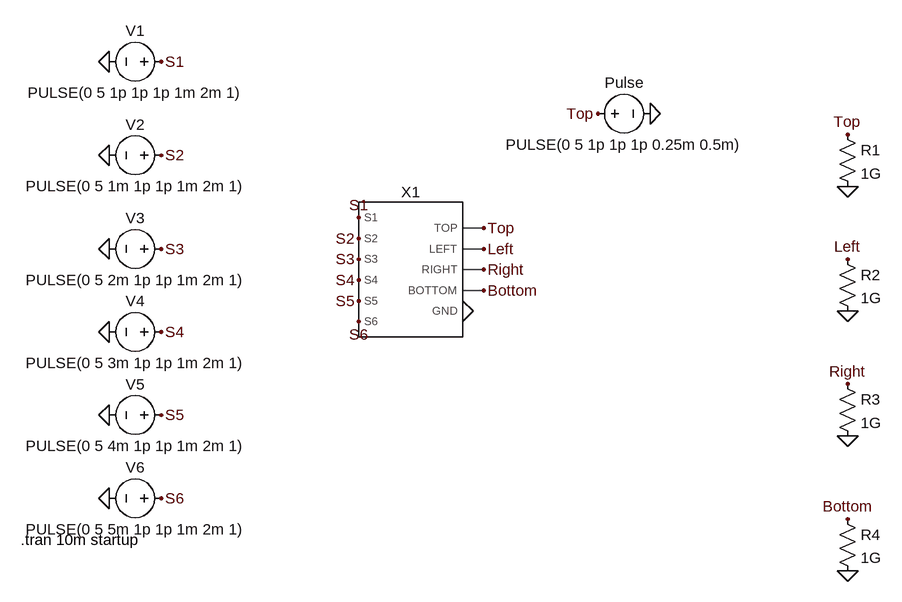
[diagram p0: schematic switch_matrix_test.asc]
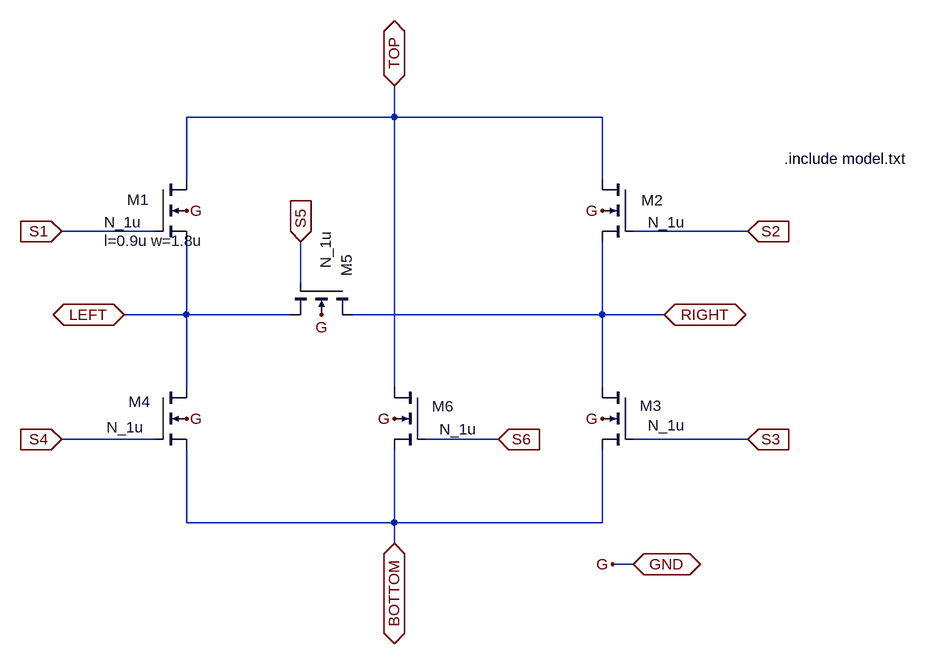
[diagram p1: sub-circuit switch_mat_new.asc]
switch_matrix_test.asc, the LTspice schematic file:
Version 4
SHEET 1 1036 704
WIRE 336 112 304 112
WIRE 336 144 304 144
WIRE 336 176 304 176
WIRE 336 208 304 208
FLAG 304 240 0
FLAG 144 96 S1
FLAG -160 -144 S1
FLAG -160 0 S2
FLAG -160 144 S3
FLAG -160 272 S4
FLAG -160 400 S5
FLAG -160 528 S6
FLAG 144 128 S2
FLAG 144 160 S3
FLAG 144 192 S4
FLAG 144 224 S5
FLAG 144 256 S6
FLAG 336 112 Top
FLAG 336 176 Right
FLAG 336 208 Bottom
FLAG 336 144 Left
FLAG -240 -144 0
FLAG -240 0 0
FLAG -240 144 0
FLAG -240 272 0
FLAG -240 400 0
FLAG -240 528 0
FLAG 592 -64 0
FLAG 512 -64 Top
FLAG 896 48 0
FLAG 896 240 0
FLAG 896 432 0
FLAG 896 640 0
FLAG 896 -32 Top
FLAG 896 160 Left
FLAG 896 352 Right
FLAG 896 560 Bottom
SYMBOL voltage -144 -144 R90
WINDOW 0 -32 56 VBottom 2
WINDOW 3 32 56 VTop 2
WINDOW 123 0 0 Left 0
WINDOW 39 0 0 Left 0
SYMATTR InstName V1
SYMATTR Value PULSE(0 5 1p 1p 1p 1m 2m 1)
SYMBOL voltage 496 -64 M90
WINDOW 0 -32 56 VBottom 2
WINDOW 3 32 56 VTop 2
WINDOW 123 0 0 Left 0
WINDOW 39 0 0 Left 0
SYMATTR InstName Pulse
SYMATTR Value PULSE(0 5 1p 1p 1p 0.25m 0.5m)
SYMBOL voltage -144 0 R90
WINDOW 0 -32 56 VBottom 2
WINDOW 3 32 56 VTop 2
WINDOW 123 0 0 Left 0
WINDOW 39 0 0 Left 0
SYMATTR InstName V2
SYMATTR Value PULSE(0 5 1m 1p 1p 1m 2m 1)
SYMBOL voltage -144 144 R90
WINDOW 0 -32 56 VBottom 2
WINDOW 3 32 56 VTop 2
WINDOW 123 0 0 Left 0
WINDOW 39 0 0 Left 0
SYMATTR InstName V3
SYMATTR Value PULSE(0 5 2m 1p 1p 1m 2m 1)
SYMBOL voltage -144 272 R90
WINDOW 0 -32 56 VBottom 2
WINDOW 3 32 56 VTop 2
WINDOW 123 0 0 Left 0
WINDOW 39 0 0 Left 0
SYMATTR InstName V4
SYMATTR Value PULSE(0 5 3m 1p 1p 1m 2m 1)
SYMBOL voltage -144 400 R90
WINDOW 0 -32 56 VBottom 2
WINDOW 3 32 56 VTop 2
WINDOW 123 0 0 Left 0
WINDOW 39 0 0 Left 0
SYMATTR InstName V5
SYMATTR Value PULSE(0 5 4m 1p 1p 1m 2m 1)
SYMBOL voltage -144 528 R90
WINDOW 0 -32 56 VBottom 2
WINDOW 3 32 56 VTop 2
WINDOW 123 0 0 Left 0
WINDOW 39 0 0 Left 0
SYMATTR InstName V6
SYMATTR Value PULSE(0 5 5m 1p 1p 1m 2m 1)
SYMBOL switch_mat_new 224 176 R0
SYMATTR InstName X1
SYMBOL res 880 -48 R0
SYMATTR InstName R1
SYMATTR Value 1G
SYMBOL res 880 144 R0
SYMATTR InstName R2
SYMATTR Value 1G
SYMBOL res 880 336 R0
SYMATTR InstName R3
SYMATTR Value 1G
SYMBOL res 880 544 R0
SYMATTR InstName R4
SYMATTR Value 1G
TEXT -376 592 Left 2 !.tran 10m startup

switch_mat_new.asc, the sub-circuit schematic file:
Version 4
SHEET 1 1664 832
WIRE 224 -64 224 -112
WIRE 224 -64 -96 -64
WIRE 544 -64 224 -64
WIRE -96 32 -96 -64
WIRE 544 32 544 -64
WIRE -144 112 -288 112
WIRE 768 112 592 112
WIRE 80 192 80 128
WIRE -96 240 -96 128
WIRE -96 240 -192 240
WIRE 64 240 -96 240
WIRE 544 240 544 128
WIRE 544 240 160 240
WIRE 640 240 544 240
WIRE -96 352 -96 240
WIRE 224 352 224 -64
WIRE 544 352 544 240
WIRE -144 432 -288 432
WIRE 384 432 272 432
WIRE 768 432 592 432
WIRE -96 560 -96 448
WIRE 224 560 224 448
WIRE 224 560 -96 560
WIRE 544 560 544 448
WIRE 544 560 224 560
WIRE 224 592 224 560
WIRE 592 624 560 624
FLAG -288 112 S1
IOPIN -288 112 In
FLAG -288 432 S4
IOPIN -288 432 In
FLAG 768 112 S2
IOPIN 768 112 In
FLAG 768 432 S3
IOPIN 768 432 In
FLAG 384 432 S6
IOPIN 384 432 In
FLAG 80 128 S5
IOPIN 80 128 In
FLAG 592 624 GND
IOPIN 592 624 BiDir
FLAG 640 240 RIGHT
IOPIN 640 240 BiDir
FLAG -192 240 LEFT
IOPIN -192 240 BiDir
FLAG 224 -112 TOP
IOPIN 224 -112 BiDir
FLAG 224 592 BOTTOM
IOPIN 224 592 BiDir
FLAG 560 624 G
FLAG 224 400 G
FLAG -96 400 G
FLAG -96 80 G
FLAG 112 240 G
FLAG 544 80 G
FLAG 544 400 G
SYMBOL nmos4 -144 32 R0
WINDOW 0 -43 31 Left 2
WINDOW 3 -79 66 Left 2
WINDOW 123 -79 94 Left 2
SYMATTR InstName M1
SYMATTR Value N_1u
SYMATTR Value2 l=0.9u w=1.8u
SYMBOL nmos4 592 32 M0
WINDOW 0 -46 32 Left 2
WINDOW 3 -80 66 Left 2
SYMATTR InstName M2
SYMATTR Value N_1u
SYMATTR Value2 l=0.9u w=1.8u
SYMBOL nmos4 592 352 M0
WINDOW 0 -44 28 Left 2
WINDOW 3 -80 58 Left 2
SYMATTR InstName M3
SYMATTR Value N_1u
SYMATTR Value2 l=0.9u w=1.8u
SYMBOL nmos4 -144 352 R0
WINDOW 0 -41 22 Left 2
WINDOW 3 -75 61 Left 2
SYMATTR InstName M4
SYMATTR Value N_1u
SYMATTR Value2 l=0.9u w=1.8u
SYMBOL nmos4 160 192 R90
WINDOW 0 -44 9 Left 2
WINDOW 3 -81 42 Left 2
SYMATTR InstName M5
SYMATTR Value N_1u
SYMATTR Value2 l=0.9u w=1.8u
SYMBOL nmos4 272 352 M0
WINDOW 0 -44 29 Left 2
WINDOW 3 -79 64 Left 2
SYMATTR InstName M6
SYMATTR Value N_1u
SYMATTR Value2 l=0.9u w=1.8u
TEXT 824 0 Left 2 !.include model.txt

The netlist it stands for:
* switch_matrix_test.asc
V1 S1 0 PULSE(0 5 1p 1p 1p 1m 2m 1)
V§Pulse Top 0 PULSE(0 5 1p 1p 1p 0.25m 0.5m)
V2 S2 0 PULSE(0 5 1m 1p 1p 1m 2m 1)
V3 S3 0 PULSE(0 5 2m 1p 1p 1m 2m 1)
V4 S4 0 PULSE(0 5 3m 1p 1p 1m 2m 1)
V5 S5 0 PULSE(0 5 4m 1p 1p 1m 2m 1)
V6 S6 0 PULSE(0 5 5m 1p 1p 1m 2m 1)
XX1 S1 S2 S3 S4 S5 S6 Bottom 0 Left Right Top switch_mat_new
R1 Top 0 1G
R2 Left 0 1G
R3 Right 0 1G
R4 Bottom 0 1G

* block symbol definitions
.subckt switch_mat_new S1 S2 S3 S4 S5 S6 BOTTOM GND LEFT RIGHT TOP
M1 TOP S1 LEFT GND N_1u l=0.9u w=1.8u
M2 TOP S2 RIGHT GND N_1u l=0.9u w=1.8u
M3 RIGHT S3 BOTTOM GND N_1u l=0.9u w=1.8u
M4 LEFT S4 BOTTOM GND N_1u l=0.9u w=1.8u
M5 RIGHT S5 LEFT GND N_1u l=0.9u w=1.8u
M6 TOP S6 BOTTOM GND N_1u l=0.9u w=1.8u
.include model.txt
.ends switch_mat_new

.model NMOS NMOS
.model PMOS PMOS
.lib standard.mos
.tran 10m startup
.backanno
.end